# EAGLE design VEML6030_Breakout (EAGLE 9.6.2)
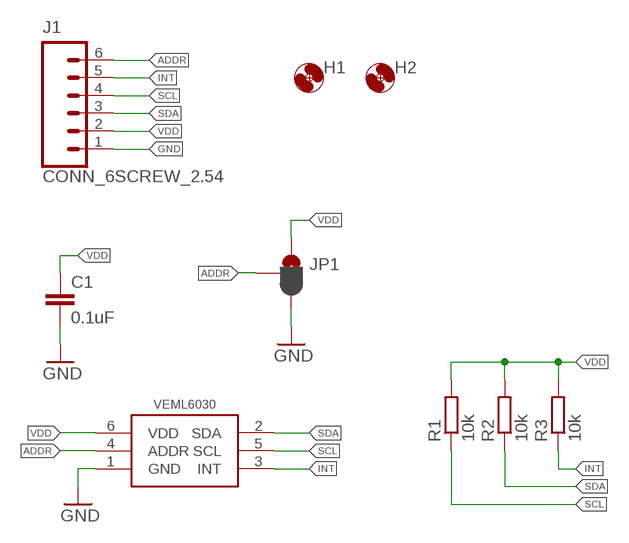
[diagram p0: schematic, sheet 1]

## Parts
C1  0.1uF  C-EU0.1UFC0603  [C0603]
H1  MOUNTING_HOLE2_NP  [2_56]
H2  MOUNTING_HOLE2_NP  [2_56]
J1  CONN_6SCREW_2.54  [1X06_SCREW]
JP1  JUMPER-SMT_3_1-NC_PASTE_SILK  [SMT-JUMPER_3_1-NC_PASTE_SILK]
R1  10k  R-EU_10KR0603  [R0603]
R2  10k  R-EU_10KR0603  [R0603]
R3  10k  R-EU_10KR0603  [R0603]
U1  VEML6030  [VEML6030]

## Nets
ADDR: J1.6 JP1.2 U1.4(ADDR)
GND: C1.2 J1.1 JP1.3 U1.1(GND)
INT: J1.5 R3.1 U1.3(INT)
SCL: J1.4 R1.1 U1.5(SCL)
SDA: J1.3 R2.1 U1.2(SDA)
VDD: C1.1 J1.2 JP1.1 R1.2 R2.2 R3.2 U1.6(VDD)

## Library data of the parts
C1 = bschulz_passives:C-EU: CAPACITOR, European symbol; DIGIKEY: 490-6051-1-ND; MF: Murata; MPN: GCM188R71E104KA57D
H1 H2 = bschulz:MOUNTING_HOLE: Genaric Mechanical Mounting Hole Hole diameter based on max body diameter + 15% Keepout ring is for diameter of socket cap screw (minimum required clearance) TPlace ring is for diameter of pan head screw (recomended clearance) Specifications: Socket Cap <http://fastener-express.com/fastener-technical/SocketscapSS-Alloy.pdf> Button Head Socket Cap <http://fastener-express.com/fastener-technical/Button-Socket-alloy.pdf> Pan Head <http://fastener-express.com/fastener-technical/pan-machine-Screws.pdf>; DIGIKEY: DNP; MF: N/A; MPN: DNP
J1 = bschulz:CONN_6: Genaric 6 terminal header Digikey 2.54_SCREW <https://www.digikey.com/product-detail/en/on-shore-technology-inc/OSTVN06A150/ED10565-ND/1588866>; DIGIKEY: ED10565-ND; MF: OnShore; MPN: OSTVN06A150
JP1 = bschulz:JUMPER-SMT_3_1-NC_PASTE: Normally closed solder jumper (1 of 2 connections) This jumper has an aperture in the stencil to allow solder paste to bridge one of the two connections. One connection is normally closed (NC), while the other is normally open (NO). Wick off the solder to open the connection. Reapply solder to reclose the connection. Apply solder to the other side instead to change the current path.; DIGIKEY: DNP; MF: N/A; MPN: N/A
R1-R3 = bschulz_passives:R-EU_: RESISTOR, European symbol Digikey Parts: Yageo, 0402 <https://www.digikey.com/products/en/resistors/chip-resistor-surface-mount/52?k=&pkeyword=&sv=0&s=4356&sf=1&FV=-1%7C13%2C7%7C2%2C1291%7C39157%2C1989%7C0%2C-8%7C52%2C3%7C1131%2C3%7C2503&quantity=&ColumnSort=0&page=1&stock=1&pageSize=25> Yageo, 0603 <https://www.digikey.com/products/en/resistors/chip-resistor-surface-mount/52?k=&pkeyword=&sv=0&pv1291=39245&sf=1&FV=-5%7C4356%2C-5%7C47360%2C-8%7C52%2C-1%7C13%2C7%7C2%2C1989%7C0&quantity=10&ColumnSort=1000011&page=1&stock=1&pageSize=25> Panasonic, 0603 <https://www.digikey.com/products/en/resistors/chip-resistor-surface-mount/52?k=&pkeyword=&pv252=68&sf=0&FV=ffec373d%2C1c0002%2C142c040c%2C1f140000%2Cffe00034%2C80002%2Cc0001&quantity=&ColumnSort=0&page=1&stock=1&pageSize=25> Panasonic, precision, 0603 <https://www.digikey.com/products/en/resistors/chip-resistor-surface-mount/52?FV=ffec4907%2Cfffc000a%2Cc0172%2C142c040c%2C1f140000%2Cffe00034%2C1c0002&quantity=100&ColumnSort=2085&page=1&stock=1&pageSize=25> Panasonic, 0805 <https://www.digikey.com/products/en/resistors/chip-resistor-surface-mount/52?k=&pkeyword=&pv3=1&sf=0&FV=ffec373d%2C1c0002%2C1f140000%2Cffe00034%2C142c040d&quantity=&ColumnSort=0&page=1&stock=1&pageSize=25> Rohm, current sense <https://www.digikey.com/products/en/resistors/chip-resistor-surface-mount/52?k=&pkeyword=&pv3=1&sf=0&FV=ffecb688%2C1f140000%2Cffe00034%2C1c0002&quantity=&ColumnSort=0&page=1&stock=1&pageSize=25> Vishay, pulse proof automotive <https://www.digikey.com/products/en/resistors/chip-resistor-surface-mount/52?k=&pkeyword=&pv7=2&sf=0&FV=ffec5d6b%2Cffe00034%2C1f140000&quantity=&ColumnSort=0&page=1&stock=1&pageSize=25>; DIGIKEY: 311-10.0KHRCT-ND; MF: Yageo; MPN: RC0603FR-0710KL; VALUE_PART: 10k
U1 = bschulz:VEML6030: VEML6030 - Ambient Light Sensor with I2C Interface Characteristics: VCC: 2.5~3.6V Operating Temperature: -40°C to 85°C Ambient Light Range: 0 ~ 120,000 Lux Digikey: VEML6030-GS15CT-ND <https://www.digikey.com/product-detail/en/vishay-semiconductor-opto-division/VEML6030-GS15/VEML6030-GS15CT-ND/6221151>; DIGIKEY: VEML6030-GS15CT-ND; MF: Vishay; MPN: VEML6030-GS15

## Board
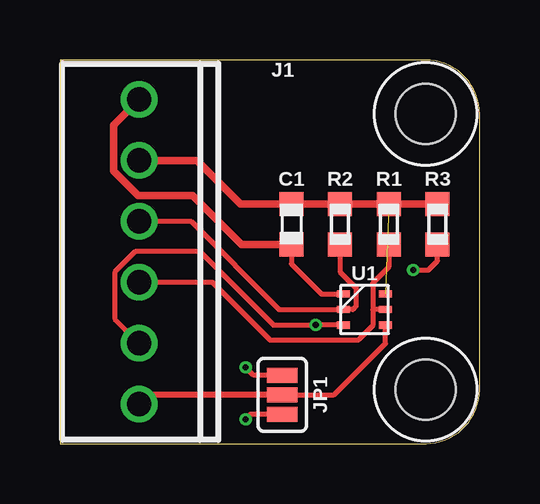
[diagram p1: board, top side]
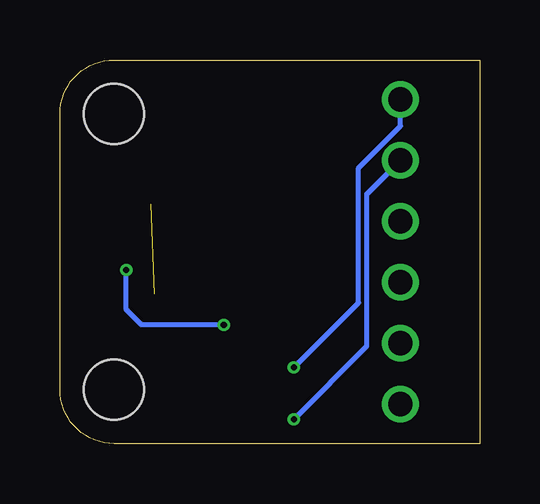
[diagram p2: board, bottom side, seen from below]

Size 17.5 x 16 mm. Coordinates in mm from the lower left corner, seen from the top.
Outline: 0,0 15.25,0 arc90 17.5,2.25 17.5,13.75 arc90 15.25,16 0,16 0,0
Copper layers (1*16): Top 0.035559375mm / dielectric 1.6mm / Bottom 0.035559375mm
Design rules "oshpark-2layer": minimum track width 6mil, minimum drill 10mil, track to track 6mil, track to pad 6mil, pad to pad 6mil, via to via 6mil, smd to smd 6mil, copper to edge 15mil, drill to drill 6mil, minimum pad ring 5mil, minimum via ring 5mil, stop-mask expansion 2.5mil, vias tented up to drill 0mil, thermal gap 10mil

### Footprints (pad centres in the part's own frame; a part is rotated, then mirrored left to right if it is on the bottom)
C0603 = smd 1 x 1: 1 -0.85,0; 2 0.85,0
2_56 = hole 2.5: 0,0
1X06_SCREW = drill 1.016: 1 -6.35,0; 2 -3.81,0; 3 -1.27,0; 4 1.27,0; 5 3.81,0; 6 6.35,0
SMT-JUMPER_3_1-NC_PASTE_SILK = smd 0.635 x 1.27: 1 -0.813,0; 2 0,0; 3 0.813,0
R0603 = smd 1 x 1: 1 -0.85,0; 2 0.85,0
VEML6030 = smd 0.55 x 0.3: 1 -0.875,0.65; 2 -0.875,0; 3 -0.875,-0.65; 4 0.875,-0.65; 5 0.875,0; 6 0.875,0.65

### Placement (x,y rotation side)
C1  9.65,9.14 270 top
H1  15.25,2.25 0 top
H2  15.25,13.75 0 top
J1  3.3,8 270 top
JP1  9.27,2.03 90 top
R1  13.72,9.14 90 top
R2  11.68,9.14 90 top
R3  15.75,9.14 90 top
U1  12.7,5.59 0 top

### Tracks (layer width: path | path; a pad name or v marks a point on that pad's centre or on a via)
ADDR
  Top 0.2: JP1.2 11.43,2.03 13.57,4.18 U1.4
  Top 0.254: JP1.2 3.68,2.03 J1.6
GND  (via drill 0.25)
  Top 0.2: C1.2 9.65,7.49 10.91,6.24 U1.1 | JP1.3 8.08,2.85 v7.75,3.17
  Top 0.305: J1.1 2.23,13.28 2.23,11.37 3.27,10.34 5.52,10.34 7.57,8.29 C1.2
  Bottom 0.2: v7.75,3.17 5.05,5.87 5.05,11.5 3.3,13.25 J1.1
INT  (via drill 0.25)
  Top 0.2: J1.5 2.29,5.21 2.29,7.15 3.14,8 5.84,8 8.9,4.94 10.65,4.94 v10.67,4.95 10.68,4.94 U1.3 | v14.73,7.24 15.37,7.24 15.75,7.62 R3.1
  Bottom 0.2: v10.67,4.95 14.1,4.95 14.73,5.59 v14.73,7.24
SCL
  Top 0.2: R1.1 13.72,7.37 13.05,6.7 13.05,5.59 | J1.4 6.35,6.73 8.76,4.32 12.45,4.32 13.05,4.92 13.05,5.59 | U1.5 13.05,5.59
SDA
  Top 0.2: J1.3 5.46,9.27 9.14,5.59 U1.2 12.21,5.59 12.35,5.73 12.35,6.49 11.68,7.16 R2.1
VDD  (via drill 0.25)  (1 unrouted)
  Top 0.2: JP1.1 7.95,1.22 v7.75,1.02
  Top 0.305: J1.2 5.71,11.81 7.53,9.99 C1.1 R2.2 R1.2 R3.2
  Bottom 0.2: v7.75,1.02 4.7,4.06 4.7,10.41 J1.2

### Text on the board
tDocu: GND | VEML6030 / Breakout | VDD | SDA | SCL | INT | 0x10 | ADDR | 0x48
bDocu: Break44 / B. Schulz